# EAGLE schematic NodeSimpleEthernet (EAGLE 4.16)
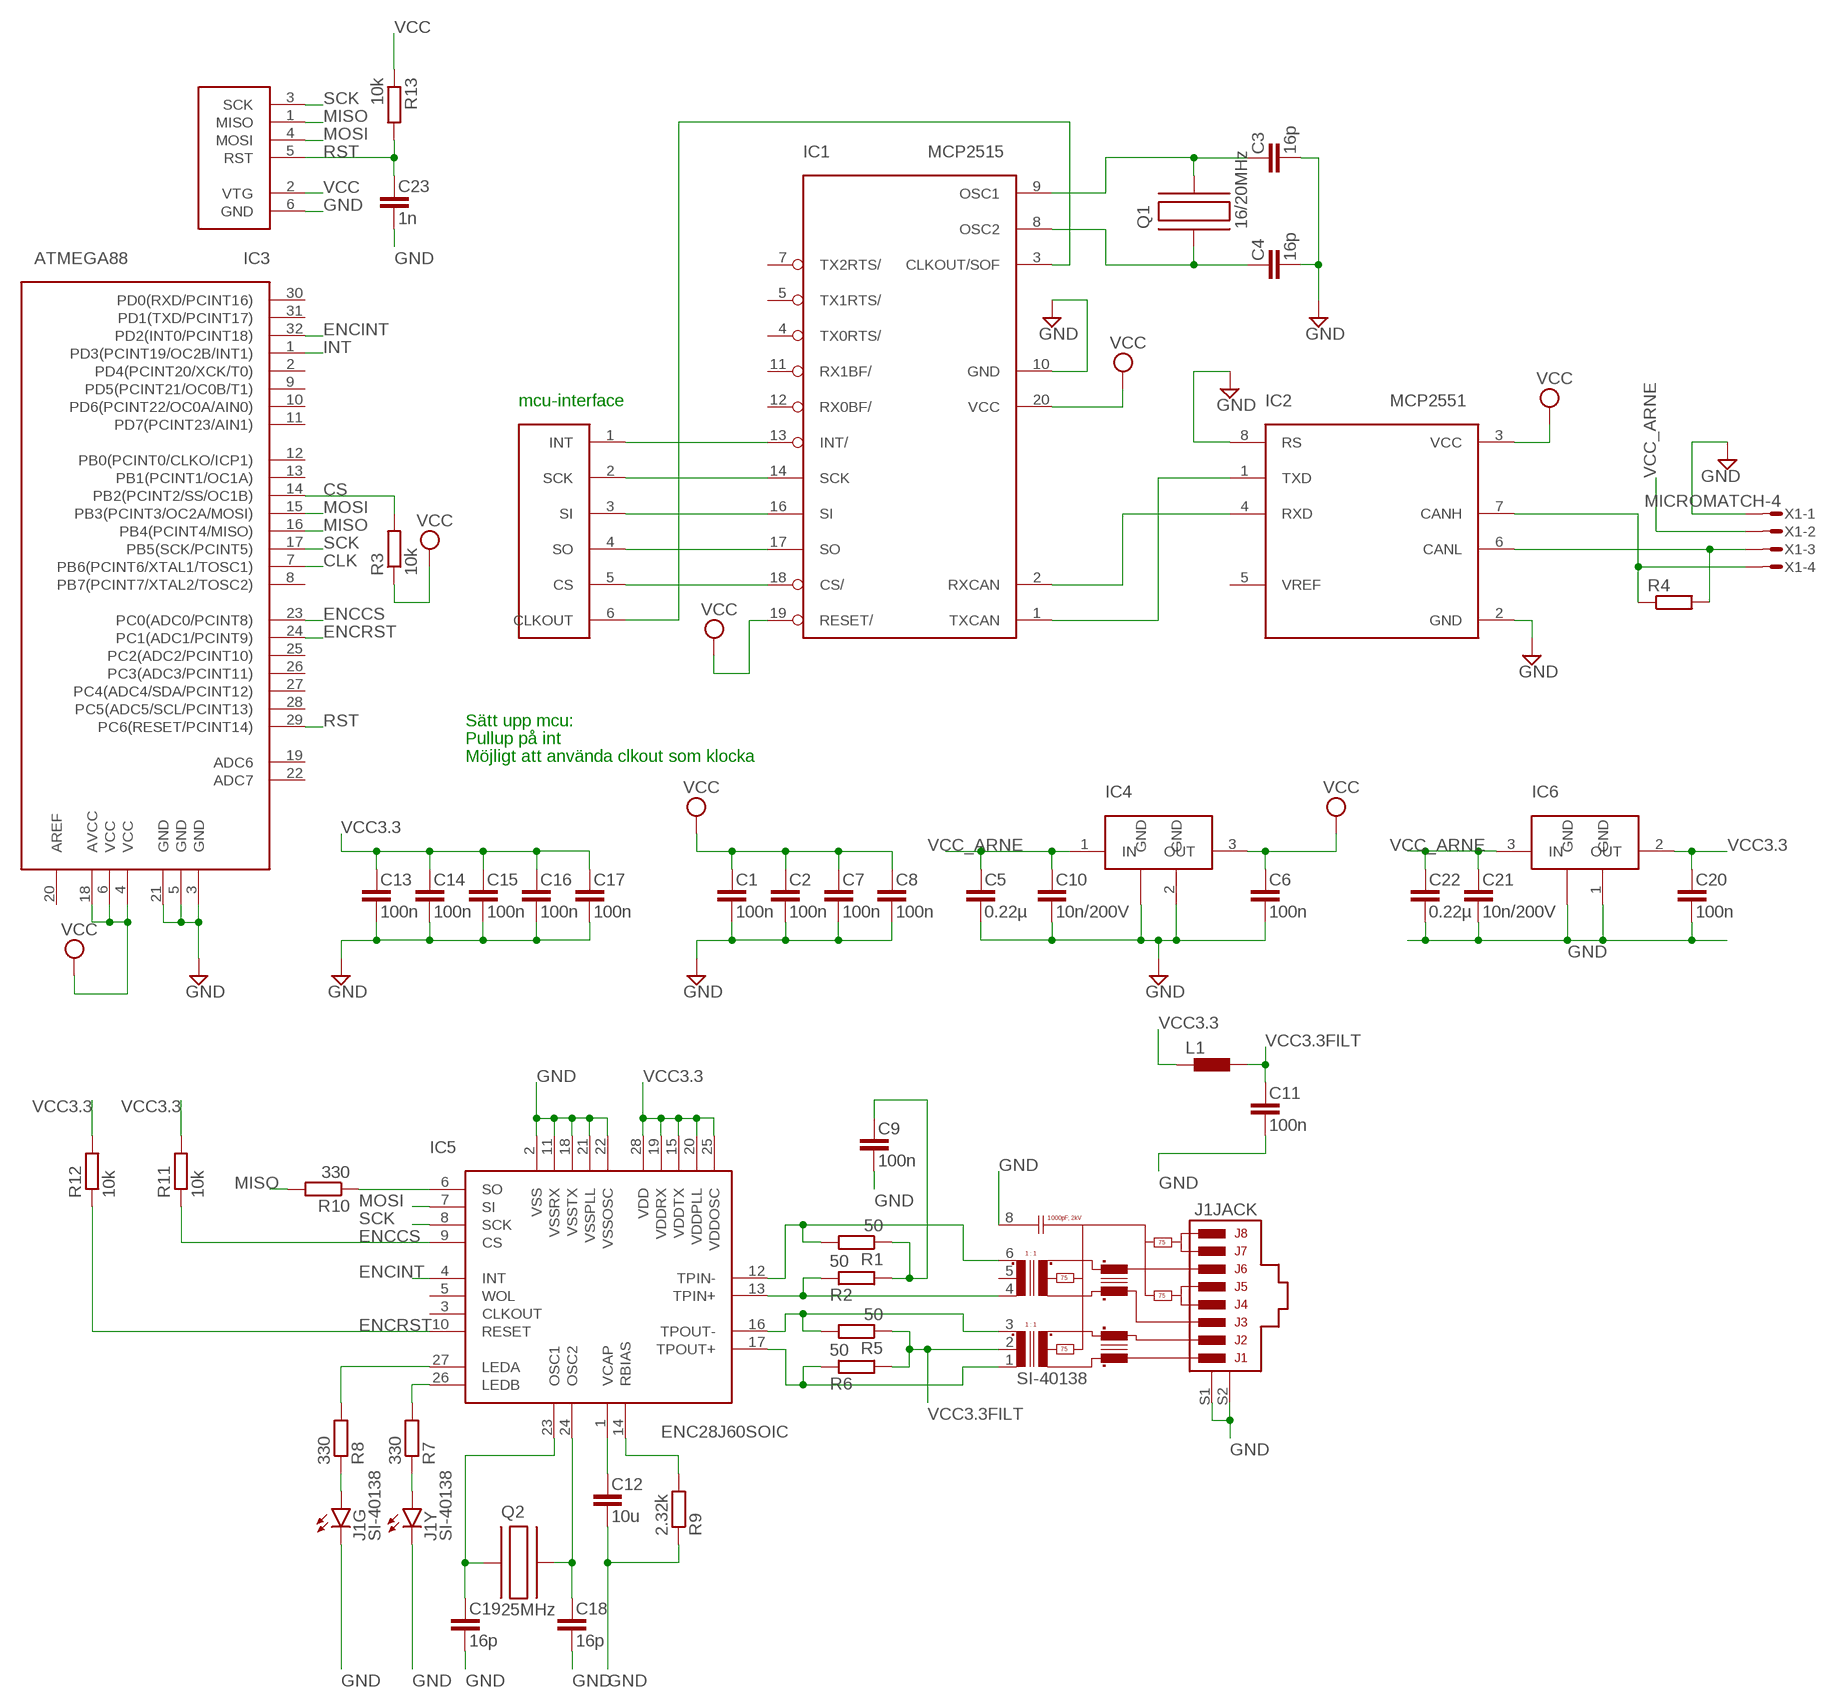
[diagram p0: schematic, sheet 1]

## Parts
C1  100n  C-EU  [C0603]
C2  100n  C-EU  [C0603]
C3  16p  C-EU  [C0603]
C4  16p  C-EU  [C0603]
C5  0.22µ  C-EU  [C0603]
C6  100n  C-EU  [C0603]
C7  100n  C-EU  [C0603]
C8  100n  C-EU  [C0603]
C9  100n  C-EU  [C0603]
C10  10n/200V  C-EU  [C0603]
C11  100n  C-EU  [C0603]
C12  10u  C-EU  [C0603]
C13  100n  C-EU  [C0603]
C14  100n  C-EU  [C0603]
C15  100n  C-EU  [C0603]
C16  100n  C-EU  [C0603]
C17  100n  C-EU  [C0603]
C18  16p  C-EU  [C0603]
C19  16p  C-EU  [C0603]
C20  100n  C-EU  [C0603]
C21  10n/200V  C-EU  [C0603]
C22  0.22µ  C-EU  [C0603]
C23  1n  C-EU  [C0603]
IC1  MCP2515  [TSSOP]
IC2  MCP2551  [SOIC]
IC3  ATMEGA88  [TQFP32]
IC4  LM340MP-5.0  [SOT223]
IC5  ENC28J60SOIC  [SOIC-28]
IC6  LM1117MP-3.3  [SOT223]
J1  SI-40138  [SI-40138]
L1  L-EUL0603  [L0603]
Q1  16/20MHz  C-MAC-LFA147E  [SMD]
Q2  25MHz  C-MAC-LFA147E  [SMD]
R1  50  R-EUR0603  [R0603]
R2  50  R-EUR0603  [R0603]
R3  10k  R-EUR0603  [R0603]
R4  R-EUR0603  [R0603]
R5  50  R-EUR0603  [R0603]
R6  50  R-EUR0603  [R0603]
R7  330  R-EUR0603  [R0603]
R8  330  R-EUR0603  [R0603]
R9  2.32k  R-EUR0603  [R0603]
R10  330  R-EUR0603  [R0603]
R11  10k  R-EUR0603  [R0603]
R12  10k  R-EUR0603  [R0603]
R13  10k  R-EUR0603  [R0603]
U$1  CAN-INTERFACE  [VIA-LIST]
X1  MICROMATCH-4  [MICROMATCH-4]
X2  AVRISP6PIN  [6PIN]

## Nets
CANH: IC2.7(CANH) R4.1 X1.4
CANL: IC2.6(CANL) R4.2 X1.3
CLK: IC1.3(CLKOUT/SOF) IC3.7(PB6(PCINT6/XTAL1/TOSC1)) U$1.6(CLKOUT)
CS: IC1.18(CS/) IC3.14(PB2(PCINT2/SS/OC1B)) R3.2 U$1.5(CS)
ENCCS: IC3.23(PC0(ADC0/PCINT8)) IC5.9(CS) R11.1
ENCINT: IC3.32(PD2(INT0/PCINT18)) IC5.4(INT)
ENCRST: IC3.24(PC1(ADC1/PCINT9)) IC5.10(RESET) R12.1
GND: C1.2 C2.2 C3.2 C4.2 C5.2 C6.2 C7.2 C8.2 C9.2 C10.2 C11.2 C12.2 C13.2 C14.2 C15.2 C16.2 C17.2 C18.2 C19.2 C20.2 C21.2 C22.2 C23.2 IC1.10(GND) IC2.2(GND) IC2.8(RS) IC3.3(GND) IC3.5(GND) IC3.21(GND) IC4.2(GND) IC4.4(GND) IC5.2(VSS) IC5.11(VSSRX) IC5.18(VSSTX) IC5.21(VSSPLL) IC5.22(VSSOSC) IC6.1(GND) IC6.4(GND) J1.8(JACK:GND) J1.GC(G:C) J1.S1(JACK:S1) J1.S2(JACK:S2) J1.YC(Y:C) R9.1 X1.1 X2.6(GND)
INT: IC1.13(INT/) IC3.1(PD3(PCINT19/OC2B/INT1)) U$1.1(INT)
MISO: IC1.17(SO) IC3.16(PB4(PCINT4/MISO)) R10.2 U$1.4(SO) X2.1(MISO)
MOSI: IC1.16(SI) IC3.15(PB3(PCINT3/OC2A/MOSI)) IC5.7(SI) U$1.3(SI) X2.4(MOSI)
N$1: IC1.2(RXCAN) IC2.4(RXD)
N$2: IC1.1(TXCAN) IC2.1(TXD)
N$3: IC5.12(TPIN-) J1.6(JACK:TD+) R1.2
N$4: IC5.13(TPIN+) J1.4(JACK:TD-) R2.1
N$5: IC5.16(TPOUT-) J1.3(JACK:RD+) R5.2
N$6: IC5.17(TPOUT+) J1.1(JACK:RD-) R6.1
N$9: IC5.27(LEDA) R8.2
N$11: C9.1 R1.1 R2.2
N$12: C3.1 IC1.9(OSC1) Q1.P$2
N$13: C4.1 IC1.8(OSC2) Q1.P$1
N$14: IC5.26(LEDB) R7.2
N$15: C19.1 IC5.23(OSC1) Q2.P$1
N$16: C18.1 IC5.24(OSC2) Q2.P$2
N$17: C12.1 IC5.1(VCAP)
N$18: IC5.14(RBIAS) R9.2
N$19: J1.YA(Y:A) R7.1
N$20: J1.GA(G:A) R8.1
RST: C23.1 IC3.29(PC6(RESET/PCINT14)) R13.2 X2.5(RST)
SCK: IC1.14(SCK) IC3.17(PB5(SCK/PCINT5)) IC5.8(SCK) U$1.2(SCK) X2.3(SCK)
SO: IC5.6(SO) R10.1
VCC: C1.1 C2.1 C6.1 C7.1 C8.1 IC1.19(RESET/) IC1.20(VCC) IC2.3(VCC) IC3.4(VCC) IC3.6(VCC) IC3.18(AVCC) IC4.3(OUT) R3.1 R13.1 X2.2(VTG)
VCC3.3: C13.1 C14.1 C15.1 C16.1 C17.1 C20.1 IC5.15(VDDTX) IC5.19(VDDRX) IC5.20(VDDPLL) IC5.25(VDDOSC) IC5.28(VDD) IC6.2(OUT) L1.1 R11.2 R12.2
VCC3.3FILT: C11.1 J1.2(JACK:CTR) L1.2 R5.1 R6.2
VCC_ARNE: C5.1 C10.1 C21.1 C22.1 IC4.1(IN) IC6.3(IN) X1.2
Unconnected: IC1.4(TX0RTS/) IC1.5(TX1RTS/) IC1.7(TX2RTS/) IC1.11(RX1BF/) IC1.12(RX0BF/) IC2.5(VREF) IC3.2(PD4(PCINT20/XCK/T0)) IC3.8(PB7(PCINT7/XTAL2/TOSC2)) IC3.9(PD5(PCINT21/OC0B/T1)) IC3.10(PD6(PCINT22/OC0A/AIN0)) IC3.11(PD7(PCINT23/AIN1)) IC3.12(PB0(PCINT0/CLKO/ICP1)) IC3.13(PB1(PCINT1/OC1A)) IC3.19(ADC6) IC3.20(AREF) IC3.22(ADC7) IC3.25(PC2(ADC2/PCINT10)) IC3.26(PC3(ADC3/PCINT11)) IC3.27(PC4(ADC4/SDA/PCINT12)) IC3.28(PC5(ADC5/SCL/PCINT13)) IC3.30(PD0(RXD/PCINT16)) IC3.31(PD1(TXD/PCINT17)) IC5.3(CLKOUT) IC5.5(WOL) J1.5(JACK:CTT)

## Notes on the sheet
- mcu-interface
- Sätt upp mcu:
- Pullup på int
- Möjligt att använda clkout som klocka

## Library data of the parts
C1-C23 = rcl:C-EU
IC1 = mcp2515:MCP2515
IC2 = mcp2551:MCP2551
IC3 = atmega88:ATMEGA88
IC4 = lm340mp:LM340MP-5.0
IC5 = enc28j60:ENC28J60
IC6 = lm1117mp:LM1117MP-3.3
J1 = stewart_magjack:SI-40138
L1 = rcl:L-EU
Q1 Q2 = hc49-4h-smx:C-MAC-LFA147E
R1-R13 = rcl:R-EU
U$1 = can-interface:CAN-INTERFACE
X1 = con-amp-micromatch:MICROMATCH-4: MicroMaTch 4 7-215464-4 / 0-215464-4 Drawing Number C-215464 DDEController.pdf
X2 = avrisp:AVRISP6PIN